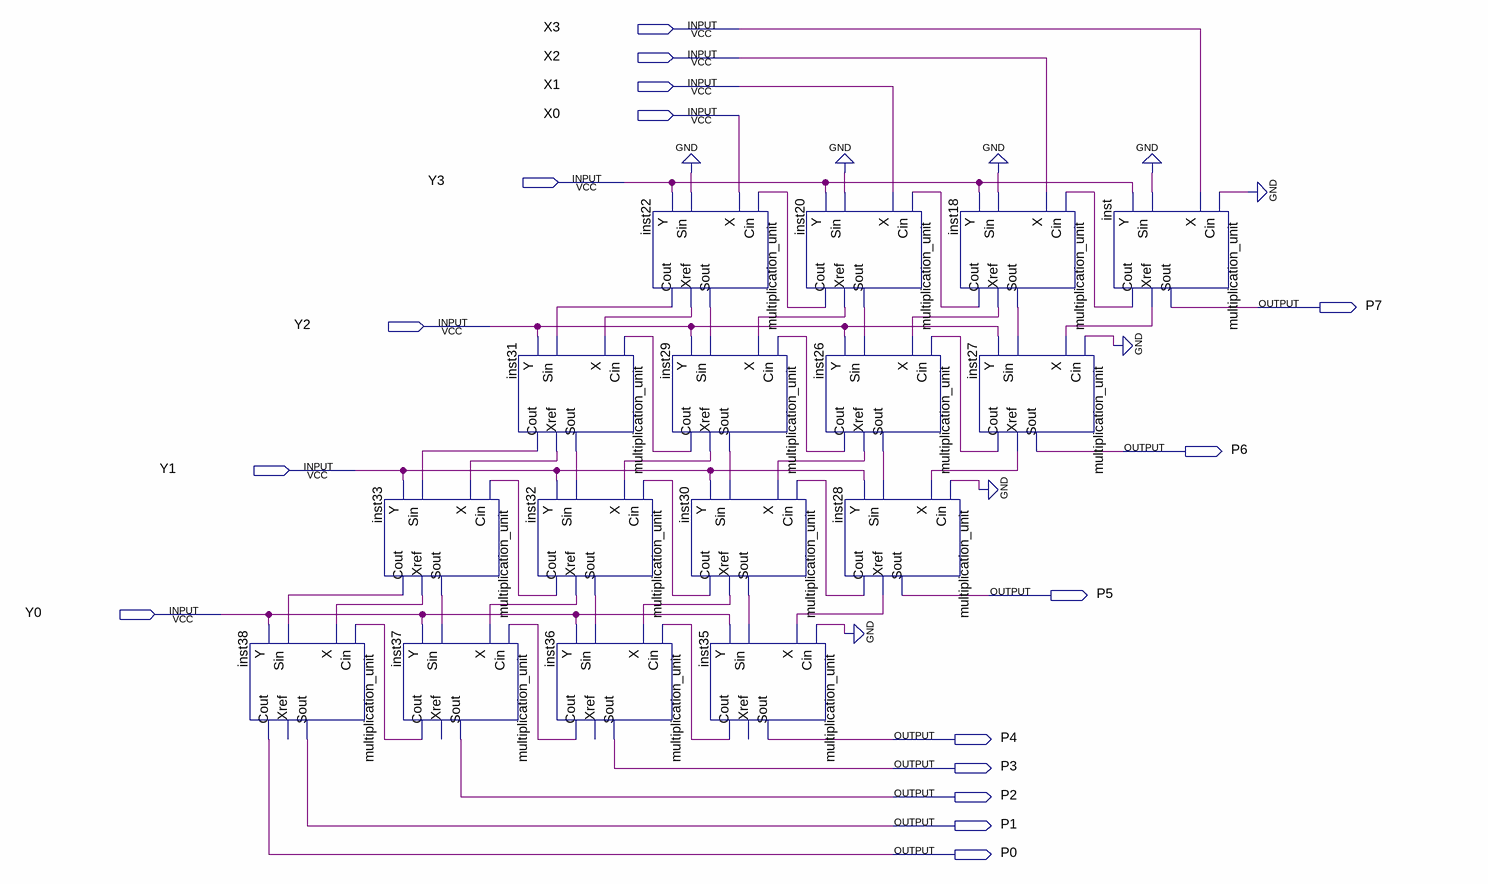
[diagram p0: schematic sheet]
// Quartus schematic project11.bdf as structural Verilog: 16 symbols, 16 pins
module project11 (
  input  X3,
  input  X2,
  input  X1,
  input  X0,
  input  Y3,
  input  Y2,
  input  Y1,
  input  Y0,
  output P7,
  output P6,
  output P5,
  output P4,
  output P3,
  output P2,
  output P1,
  output P0
);

  wire inst18_cout, inst18_sout, inst18_xref, inst20_cout, inst20_sout, inst20_xref, inst22_cout,
       inst22_sout, inst22_xref, inst26_cout, inst26_sout, inst26_xref, inst27_cout, inst27_xref,
       inst28_cout, inst28_xref, inst29_cout, inst29_sout, inst29_xref, inst30_cout, inst30_sout,
       inst30_xref, inst31_cout, inst31_sout, inst31_xref, inst32_cout, inst32_sout, inst32_xref,
       inst33_cout, inst33_sout, inst33_xref, inst35_cout, inst36_cout, inst37_cout, inst_cout, inst_xref;

  multiplication_unit inst38 (
    .X(inst33_xref), .Y(Y0), .Cin(inst37_cout), .Sin(inst33_cout), .Sout(P1), .Cout(P0));  // open: Xref
  multiplication_unit inst33 (
    .X(inst31_xref), .Y(Y1), .Cin(inst32_cout), .Sin(inst31_cout), .Xref(inst33_xref), .Sout(inst33_sout),
    .Cout(inst33_cout));
  multiplication_unit inst37 (
    .X(inst32_xref), .Y(Y0), .Cin(inst36_cout), .Sin(inst33_sout), .Sout(P2), .Cout(inst37_cout));  // open: Xref
  multiplication_unit inst31 (
    .X(inst22_xref), .Y(Y2), .Cin(inst29_cout), .Sin(inst22_cout), .Xref(inst31_xref), .Sout(inst31_sout),
    .Cout(inst31_cout));
  multiplication_unit inst32 (
    .X(inst29_xref), .Y(Y1), .Cin(inst30_cout), .Sin(inst31_sout), .Xref(inst32_xref), .Sout(inst32_sout),
    .Cout(inst32_cout));
  multiplication_unit inst36 (
    .X(inst30_xref), .Y(Y0), .Cin(inst35_cout), .Sin(inst32_sout), .Sout(P3), .Cout(inst36_cout));  // open: Xref
  multiplication_unit inst22 (
    .X(X0), .Y(Y3), .Cin(inst20_cout), .Sin(1'b0), .Xref(inst22_xref), .Sout(inst22_sout), .Cout(inst22_cout));
  multiplication_unit inst29 (
    .X(inst20_xref), .Y(Y2), .Cin(inst26_cout), .Sin(inst22_sout), .Xref(inst29_xref), .Sout(inst29_sout),
    .Cout(inst29_cout));
  multiplication_unit inst30 (
    .X(inst26_xref), .Y(Y1), .Cin(inst28_cout), .Sin(inst29_sout), .Xref(inst30_xref), .Sout(inst30_sout),
    .Cout(inst30_cout));
  multiplication_unit inst35 (
    .X(inst28_xref), .Y(Y0), .Cin(1'b0), .Sin(inst30_sout), .Sout(P4), .Cout(inst35_cout));  // open: Xref
  multiplication_unit inst20 (
    .X(X1), .Y(Y3), .Cin(inst18_cout), .Sin(1'b0), .Xref(inst20_xref), .Sout(inst20_sout), .Cout(inst20_cout));
  multiplication_unit inst26 (
    .X(inst18_xref), .Y(Y2), .Cin(inst27_cout), .Sin(inst20_sout), .Xref(inst26_xref), .Sout(inst26_sout),
    .Cout(inst26_cout));
  multiplication_unit inst28 (
    .X(inst27_xref), .Y(Y1), .Cin(1'b0), .Sin(inst26_sout), .Xref(inst28_xref), .Sout(P5), .Cout(inst28_cout));
  multiplication_unit inst18 (
    .X(X2), .Y(Y3), .Cin(inst_cout), .Sin(1'b0), .Xref(inst18_xref), .Sout(inst18_sout), .Cout(inst18_cout));
  multiplication_unit inst27 (
    .X(inst_xref), .Y(Y2), .Cin(1'b0), .Sin(inst18_sout), .Xref(inst27_xref), .Sout(P6), .Cout(inst27_cout));
  multiplication_unit inst (.X(X3), .Y(Y3), .Cin(1'b0), .Sin(1'b0), .Xref(inst_xref), .Sout(P7), .Cout(inst_cout));
endmodule
